# Altium project Guitar_Multi_Effect_PCB.PrjPcb
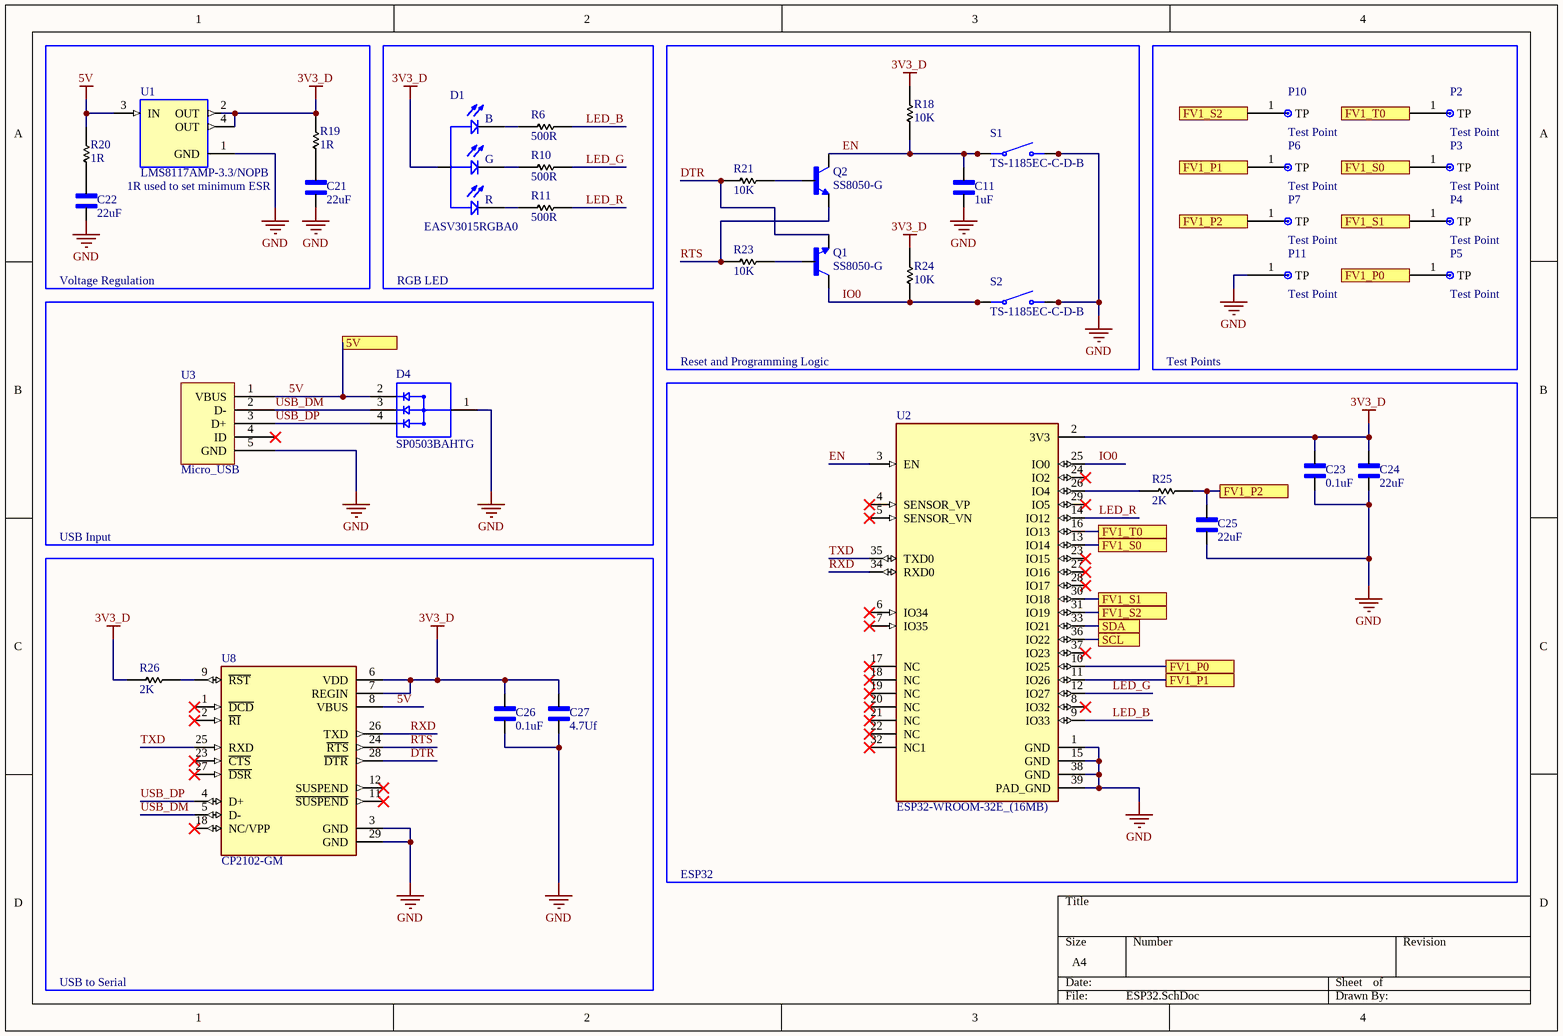
[diagram p0: ESP32.SchDoc]
2 sheets, 81 parts. Net scope: flat (ports and power ports of the same name join across sheets).
Board file: Effect_PCB.PcbDoc
Sheets:
  ESP32.SchDoc
  FV-1.SchDoc

## Sheet ESP32.SchDoc
size A4

### Parts
C11  1uF  [CHIP_0603]
C21  22uF  [CHIP_0603]
C22  22uF  [CHIP_0603]
C23  0.1uF  [CHIP_0603]
C24  22uF  [CHIP_0603]
C25  22uF  [CHIP_0603]
C26  0.1uF  [CHIP_0603]
C27  4.7Uf  [CHIP_0603]
D1  EASV3015RGBA0  [LED_EASV3015RGBA0]
D4  SP0503BAHTG  [SP0503BAHTG]
P2  Test Point  [1 Solder Pad]
P3  Test Point  [1 Solder Pad]
P4  Test Point  [1 Solder Pad]
P5  Test Point  [1 Solder Pad]
P6  Test Point  [1 Solder Pad]
P7  Test Point  [1 Solder Pad]
P10  Test Point  [1 Solder Pad]
P11  Test Point  [1 Solder Pad]
Q1  SS8050-G  [SS8050-G]
Q2  SS8050-G  [SS8050-G]
R6  500R  [CHIP_R_0603]
R10  500R  [CHIP_R_0603]
R11  500R  [CHIP_R_0603]
R18  10K  [CHIP_R_0603]
R19  1R  [CHIP_R_0603]
R20  1R  [CHIP_R_0603]
R21  10K  [CHIP_R_0603]
R23  10K  [CHIP_R_0603]
R24  10K  [CHIP_R_0603]
R25  2K  [CHIP_R_0603]
R26  2K  [CHIP_R_0603]
S1  TS-1185EC-C-D-B  [TS-1185EC-C-D-B]
S2  TS-1185EC-C-D-B  [TS-1185EC-C-D-B]
U1  LMS8117AMP-3.3/NOPB  [SOT230P700X180-4N]
U2  ESP32-WROOM-32E_(16MB)  [MODULE_ESP32-WROOM-32E]
U3  Micro_USB  [U254-051T-4BH83-F1S]
U8  CP2102-GM  [QFN50P500X500X100-29N]

### Blocks framed on the sheet
RGB LED: D1 R6 R10 R11
Reset and Programming Logic: C11 Q1 Q2 R18 R21 R23 R24 S1 S2
Test Points: P2-P7 P10 P11
ESP32: C23-C25 R25 U2

### Ports
5V, FV1_P0, FV1_P1, FV1_P2, FV1_S0, FV1_S1, FV1_S2, FV1_T0, SCL, SDA

### Nets
3V3_D: C23.1 C24.1 C26.1 C27.1 D1.1 R18.1 R19.1 R24.1 R26.2 U1.2(OUT) U1.4(OUT) U2.2(3V3) U8.6(VDD) U8.7(REGIN)
5V: D4.2 R20.1 U1.3(IN) U3.1(VBUS) U8.8(VBUS) ; port 5V
GND: C11.2 C21.2 C22.2 C23.2 C24.2 C25.2 C26.2 C27.2 D4.1 P11.1(TP) S1.3(NO) S1.4(NO) S2.3(NO) S2.4(NO) U1.1(GND) U2.1(GND) U2.15(GND) U2.38(GND) U2.39(PAD_GND) U3.5(GND) U8.3(GND) U8.29(GND)
DTR: Q1.2(E) R21.2 U8.28(~{DTR})
EN: C11.1 Q2.3(C) R18.2 S1.1(COM) S1.2(COM) U2.3(EN)
IO0: Q1.3(C) R24.2 S2.1(COM) S2.2(COM) U2.25(IO0)
LED_B: R6.1 U2.9(IO33)
LED_G: R10.1 U2.12(IO27)
LED_R: R11.1 U2.14(IO12)
RTS: Q2.2(E) R23.2 U8.24(~{RTS})
RXD: U2.34(RXD0) U8.26(TXD)
SCL: U2.36(IO22) ; port SCL
SDA: U2.33(IO21) ; port SDA
TXD: U2.35(TXD0) U8.25(RXD)
USB_DM: D4.3 U3.2(D-) U8.5(D-)
USB_DP: D4.4 U3.3(D+) U8.4(D+)
NetC21_1: C21.1 R19.2
NetC22_1: C22.1 R20.2
NetC25_1: C25.1 P7.1(TP) R25.2 ; port FV1_P2
NetD1_2: D1.2 R6.2
NetD1_3: D1.3 R10.2
NetD1_4: D1.4 R11.2
NetP2_1: P2.1(TP) U2.16(IO13) ; port FV1_T0
NetP3_1: P3.1(TP) U2.13(IO14) ; port FV1_S0
NetP4_1: P4.1(TP) U2.30(IO18) ; port FV1_S1
NetP5_1: P5.1(TP) U2.10(IO25) ; port FV1_P0
NetP6_1: P6.1(TP) U2.11(IO26) ; port FV1_P1
NetP10_1: P10.1(TP) U2.31(IO19) ; port FV1_S2
NetQ1_1: Q1.1(B) R23.1
NetQ2_1: Q2.1(B) R21.1
NetR25_1: R25.1 U2.26(IO4)
NetR26_1: R26.1 U8.9(~{RST})

Not connected (* = marked no-connect by the designer): U2 4(SENSOR_VP)* 5(SENSOR_VN)* 6(IO34)* 7(IO35)* 8(IO32)* 17(NC)* 18(NC)* 19(NC)* 20(NC)* 21(NC)* 22(NC)* 23(IO15)* 24(IO2)* 27(IO16)* 28(IO17)* 29(IO5)* 32(NC1)* 37(IO23)*; U3 4(ID)*; U8 1(~{DCD})* 2(~{RI})* 11(~{SUSPEND})* 12(SUSPEND)* 18(NC/VPP)* 23(~{CTS})* 27(~{DSR})*

### Notes on the sheet
- 1R used to set minimum ESR
- Voltage Regulation
- USB Input
- USB to Serial
- (in symbol EASV3015RGBA0) B; G; R

### Library data of the parts
C11 C21-C27 = 0603 Ceramic Capacitor: Generic 0603 Ceramic Capacitor; MP: AC0402FR-071ML; MF: Yageo; Package: 1005 Yageo; SnapEDA_Link: https://www.snapeda.com/parts/AC0402FR-071ML/Yageo/view-part/940461/?ref=snap; Value: *; Mouser-Purchase-URL: https://snapeda.com/shop?store=Mouser&id=940461; DigiKey-Purchase-URL: https://snapeda.com/shop?store=DigiKey&id=940461
D1 = EASV3015RGBA0: Red, Green, Blue _RGB_ 624nm Red, 525nm Green, 470nm Blue LED Indication - Discrete 2V Red, 3.3V Green, 3.3V Blue 4-SMD, No Lead; MF: Everlight Electronics; SnapEDA_Link: https://www.snapeda.com/parts/EASV3015RGBA0/Everlight%20Electronics%20Co%20Ltd/view-part/1921996/?ref=snap; Value: *; Price: None; Availability: Unavailable; MP: EASV3015RGBA0; Package: SMD-4 Everlight Electronics
D4 = SP0503BAHTG: 8.5V Clamp Ipp Tvs Diode Surface Mount SOT-143-4; MF: Littelfuse Inc.; MP: SP0503BAHTG; Package: SOT-143 Littelfuse; SnapEDA_Link: https://www.snapeda.com/parts/SP0503BAHTG/Littelfuse%20Inc./view-part/214427/?ref=snap; Digi-Key_Purchase_URL: https://www.digikey.com/product-detail/en/littelfuse-inc/SP0503BAHTG/F2715CT-ND/1154322?utm_source=snapeda&utm_medium=aggregator&utm_campaign=symbol; Value: *; Digi-Key_Part_Number: F2715CT-ND
P2-P7 P10 P11 = Single Test Point
Q1 Q2 = SS8050-G: NPN TRANSISTOR 1.5A 40V SOT-23 R
R6 R10 R11 R18-R21 R23-R26 = 0603 Generic Resistor: Generic 0603 Resistor
S1 S2 = TS-1185EC-C-D-B: SMD Tactile Switche - 3mm 2mm 50mA 3.65mm SPST 12V
U1 = LMS8117AMP-3.3/NOPB: Fixed 3.3V LDO 1A 15V input SOT-223   Cap ESR between 0.5-5R, 10uF minimum; MF: Texas Instruments; SnapEDA_Link: https://www.snapeda.com/parts/LMS8117AMP-3.3/NOPB/Texas%20Instruments/view-part/104396/?ref=snap; Price: None; Check_prices: https://www.snapeda.com/parts/LMS8117AMP-3.3/NOPB/Texas%20Instruments/view-part/104396/?ref=eda; Purchase-URL: https://pricing.snapeda.com/search/part/LMS8117AMP-3.3/NOPB/?ref=eda; Value: *; MP: LMS8117AMP-3.3/NOPB; Package: SOT-223-4 Texas Instruments; Availability: Warning
U2 = ESP32-WROOM-32E_(16MB): Bluetooth, WiFi 802.11b/g/n, Bluetooth v4.2 +EDR, Class 1, 2 and 3 Transceiver Module 2.4GHz ~ 2.5GHz Integrated, Trace Surface Mount; MP: ESP32-WROOM-32E (16MB); MF: Espressif Systems; Value: *; SnapEDA_Link: https://www.snapeda.com/parts/ESP32-WROOM-32E%20(16MB)/Espressif%20Systems/view-part/4792564/?ref=snap; Check_prices: https://www.snapeda.com/parts/ESP32-WROOM-32E%20(16MB)/Espressif%20Systems/view-part/4792564/?ref=eda; Availability: Unavailable; Price: None; Package: None
U3 = Micro_USB: XKB Connectivity U254-051T-4BH83-F1S
U8 = CP2102-GM: USB Bridge, USB to UART USB 2.0 UART Interface 28-QFN _5x5_; MF: Silicon Labs; Package: QFN-28 Silicon Labs; Value: *; Price: None; MP: CP2102-GM; Availability: Unavailable; SnapEDA_Link: https://www.snapeda.com/parts/CP2102-GM/Silicon%20Labs/view-part/135876/?ref=snap

## Sheet FV-1.SchDoc
size A4
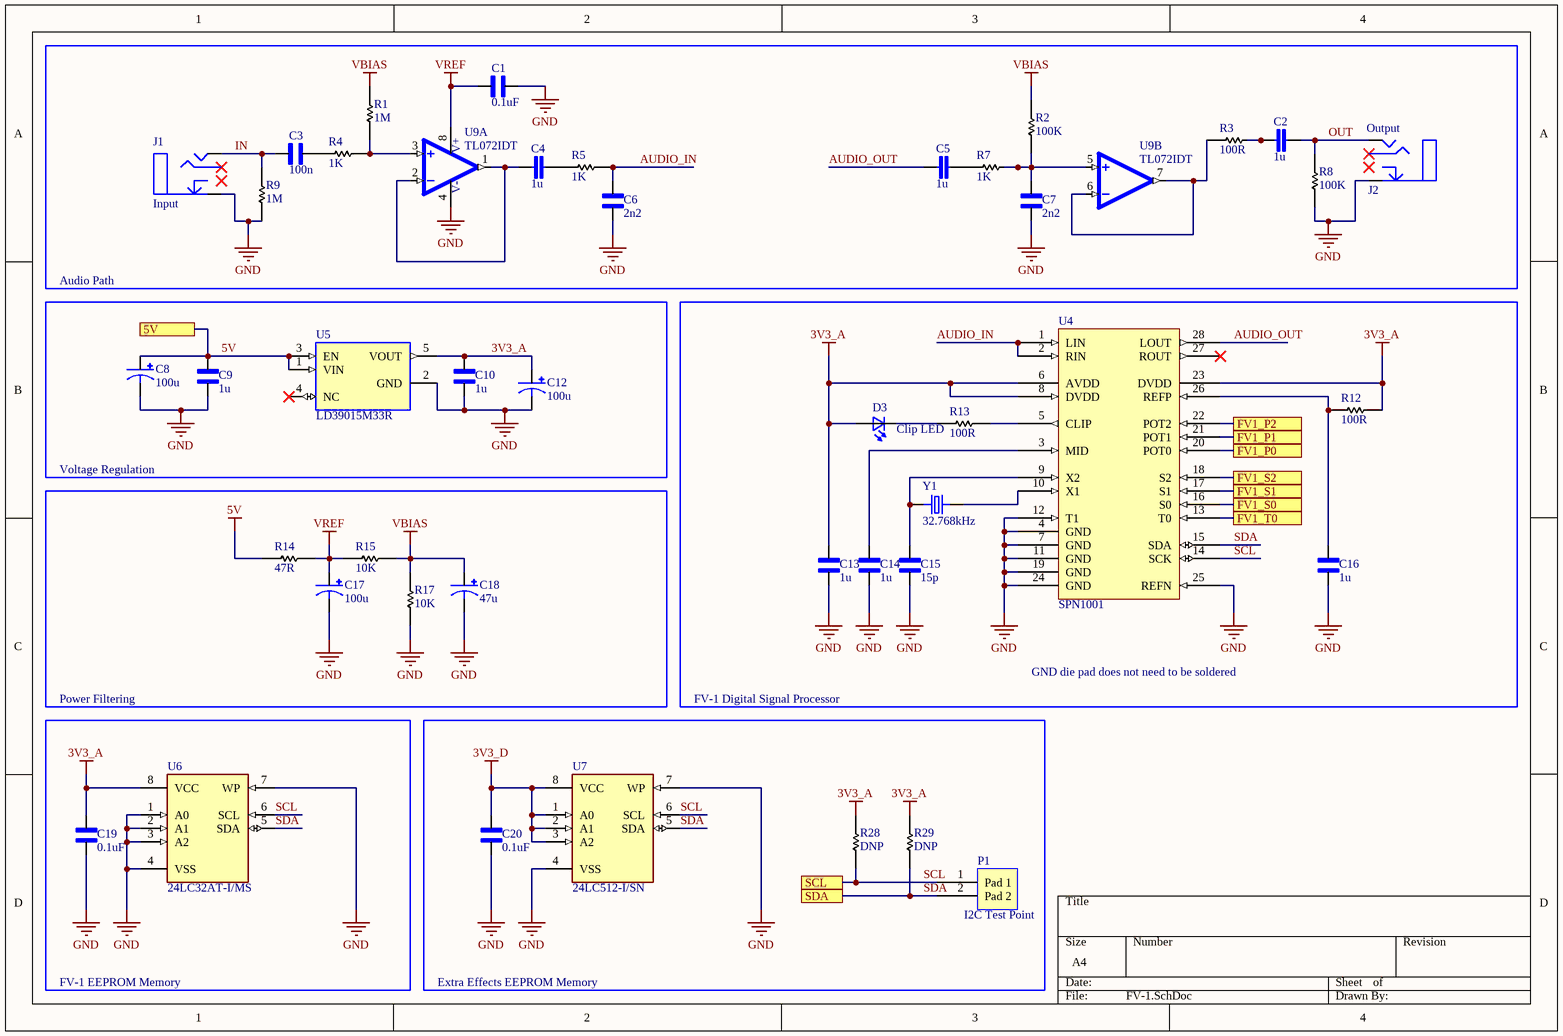
[diagram p1: FV-1.SchDoc]

### Parts
C1  0.1uF  [CHIP_0603]
C2  1u  [CHIP_1210]
C3  100n  [CAPC3216X180N]
C4  1u  [CHIP_1210]
C5  1u  [CHIP_1210]
C6  2n2  [CHIP_0603]
C7  2n2  [CHIP_0603]
C8  100u  [UCD1E101MCL1GS]
C9  1u  [CHIP_0603]
C10  1u  [CHIP_0603]
C12  100u  [UCD1E101MCL1GS]
C13  1u  [CHIP_0603]
C14  1u  [CHIP_0603]
C15  15p  [CHIP_0603]
C16  1u  [CHIP_0603]
C17  100u  [UCD1E101MCL1GS]
C18  47u  [EEE1EA470WAP]
C19  0.1uF  [CHIP_0603]
C20  0.1uF  [CHIP_0603]
D3  Clip LED  [0603 LED Generic]
J1  Input  [2 Test Points]
J2  Output  [2 Test Points]
P1  I2C Test Point  [2 Test Points]
R1  1M  [CHIP_R_0603]
R2  100K  [CHIP_R_0603]
R3  100R  [CHIP_R_0603]
R4  1K  [CHIP_R_0603]
R5  1K  [CHIP_R_0603]
R7  1K  [CHIP_R_0603]
R8  100K  [CHIP_R_0603]
R9  1M  [CHIP_R_0603]
R12  100R  [CHIP_R_0603]
R13  100R  [CHIP_R_0603]
R14  47R  [CHIP_R_0603]
R15  10K  [CHIP_R_0603]
R17  10K  [CHIP_R_0603]
R28  DNP  [CHIP_R_0603]
R29  DNP  [CHIP_R_0603]
U4  SPN1001  [SOIC-28]
U5  LD39015M33R  [SOT-23]
U6  24LC32AT-I/MS  [24LC32AT-I/MS]
U7  24LC512-I/SN  [24LC512-I/SN]
U9  TL072IDT  [TL072BIDT]  (parts A,B of 2)
Y1  32.768kHz  [XTAL_ABS07-32.768KHZ-T]

### Blocks framed on the sheet
Audio Path: C1-C7 J1 J2 R1-R5 R7-R9 U9

### Ports
5V, FV1_P0, FV1_P1, FV1_P2, FV1_S0, FV1_S1, FV1_S2, FV1_T0, SCL, SDA

### Nets
3V3_A: C10.1 C12.+ C13.1 C19.1 D3.2(A2) R12.2 R28.1 R29.1 U4.6(AVDD) U4.8(DVDD) U4.23(DVDD) U5.5(VOUT) U6.8(VCC)
3V3_D: C20.1 U7.1(A0) U7.2(A1) U7.3(A2) U7.8(VCC)
5V: C8.+ C9.1 R14.2 U5.1(VIN) U5.3(EN) ; port 5V
GND: C1.2 C6.2 C7.2 C8.- C9.2 C10.2 C12.- C13.2 C14.2 C15.2 C16.2 C17.- C18.- C19.2 C20.2 J1.2 J2.2 R8.2 R9.2 R17.2 U4.4(GND) U4.7(GND) U4.11(GND) U4.12(T1) U4.19(GND) U4.24(GND) U4.25(REFN) U5.2(GND) U6.1(A0) U6.2(A1) U6.3(A2) U6.4(VSS) U6.7(WP) U7.4(VSS) U7.7(WP) U9.4(V-)
VBIAS: C18.+ R1.1 R2.1 R15.1 R17.1
VREF: C1.1 C17.+ R14.1 R15.2 U9.8(V+)
AUDIO_IN: C6.1 R5.2 U4.1(LIN) U4.2(RIN)
AUDIO_OUT: C5.2 U4.28(LOUT)
IN: C3.2 J1.1 R9.1
OUT: C2.1 J2.1 R8.1
SCL: P1.1(Pad_1) R28.2 U4.14(SCK) U6.6(SCL) U7.6(SCL) ; port SCL
SDA: P1.2(Pad_2) R29.2 U4.15(SDA) U6.5(SDA) U7.5(SDA) ; port SDA
NetC2_2: C2.2 R3.2
NetC3_1: C3.1 R4.1
NetC4_1: C4.1 R5.1
NetC4_2: C4.2 U9.1(OUT1) U9.2(-IN1)
NetC5_1: C5.1 R7.1
NetC7_1: C7.1 R2.2 R7.2 U9.5(+IN2)
NetC14_1: C14.1 U4.3(MID)
NetC15_1: C15.1 U4.9(X2) Y1.2
NetC16_1: C16.1 R12.1 U4.26(REFP)
NetC25_1: U4.22(POT2) ; port FV1_P2
NetD3_1: D3.1(K2) R13.1
NetP2_1: U4.13(T0) ; port FV1_T0
NetP3_1: U4.16(S0) ; port FV1_S0
NetP4_1: U4.17(S1) ; port FV1_S1
NetP5_1: U4.20(POT0) ; port FV1_P0
NetP6_1: U4.21(POT1) ; port FV1_P1
NetP10_1: U4.18(S2) ; port FV1_S2
NetR1_2: R1.2 R4.2 U9.3(+IN1)
NetR3_1: R3.1 U9.6(-IN2) U9.7(OUT2)
NetR13_2: R13.2 U4.5(CLIP)
NetU4_10: U4.10(X1) Y1.1

Not connected (* = marked no-connect by the designer): U4 27(ROUT)*; U5 4(NC)*

### Notes on the sheet
- Voltage Regulation
- Power Filtering
- FV-1 Digital Signal Processor
- GND die pad does not need to be soldered
- FV-1 EEPROM Memory
- Extra Effects EEPROM Memory

### Library data of the parts
C1 C9 C10 C13-C16 C19 C20 = 0603 Ceramic Capacitor: as C11 on sheet ESP32; Package: 1005 Yageo; SnapEDA_Link: https://www.snapeda.com/parts/AC0402FR-071ML/Yageo/view-part/940461/?ref=snap; Value: *; Mouser-Purchase-URL: https://snapeda.com/shop?store=Mouser&id=940461; DigiKey-Purchase-URL: https://snapeda.com/shop?store=DigiKey&id=940461
C2 C4 C5 = ECP-U1C105MA5: CAP FILM 1UF 16V 20%; Manufacturer: Panasonic; Dielectric: PPS; Dissipation Factor: 1.5%; Insulation Resistance: 300MR; Supplier 1: Farnell; Supplier Part Number 1: 9694315; Manufacturer Part Number: ECP-U1C105MA5; RoHS: Yes; Category: Film Capacitors; Stock: 7744; Pricing: 5=0.65900, 50=0.39900, 250=0.33300, 500=0.27300, 1000=0.26400 (EUR); Mount: Surface Mount; Case/Package: 1210; Number of Pins: 2; Case Code (Metric): 3225; Contact Plating: Copper,Tin,Silver; Case Code (Imperial): 1210; Min Operating Temperature: -40°C; Max Operating Temperature: 85°C; Capacitance: 1uF; Tolerance: 20%; Termination: SMD/SMT; Voltage: 16V; Packaging: Tape and Reel; Package Quantity: 1; Voltage Rating: 16V; Voltage Rating (DC): 16V; Length: 3.2mm; Height: 1.4mm; Depth: 2.5mm; Height - Seated (Max): 0.063inch; Width: 2.5mm; Radiation Hardening: No; Lead Free: Lead Free; REACH SVHC: No SVHC; ComponentLink1URL: https://datasheet.ciiva.com/24023/abd0000ce12-181823-24023616.pdf?src-supplier=Mouser; ComponentLink1Description: https://datasheet.ciiva.com/24023/abd0000ce12-181823-24023616.pdf?src-supplier=Mouser; ComponentLink2URL: https://datasheet.ciiva.com/34303/1983192-34303533.pdf?src-supplier=Jameco; ComponentLink2Description: https://datasheet.ciiva.com/34303/1983192-34303533.pdf?src-supplier=Jameco; ComponentLink3URL: https://datasheet.ciiva.com/11790/0900766b80f2ea72-11790686.pdf?src-supplier=RSComponents; ComponentLink3Description: https://datasheet.ciiva.com/11790/0900766b80f2ea72-11790686.pdf?src-supplier=RSComponents; ComponentLink4URL: https://datasheet.ciiva.com/2992/abd0000ce12-2992994.pdf?src-supplier=Avnet; ComponentLink4Description: https://datasheet.ciiva.com/2992/abd0000ce12-2992994.pdf?src-supplier=Avnet; ComponentLink5URL: https://datasheet.ciiva.com/2992/abd0000ce12-2992995.pdf?src-supplier=Avnet; ComponentLink5Description: https://datasheet.ciiva.com/2992/abd0000ce12-2992995.pdf?src-supplier=Avnet; ComponentLink6URL: https://datasheet.ciiva.com/46399/31740-46399788.pdf?src-supplier=Element14; ComponentLink6Description: https://datasheet.ciiva.com/46399/31740-46399788.pdf?src-supplier=Element14; ComponentLink7URL: https://datasheet.ciiva.com/16433/abd0000ce12-16433502.pdf?src-supplier=Future+Electronics; ComponentLink7Description: https://datasheet.ciiva.com/16433/abd0000ce12-16433502.pdf?src-supplier=Future+Electronics; ComponentLink8URL: https://datasheet.ciiva.com/5710/31740-5710134.pdf?src-supplier=Farnell; ComponentLink8Description: https://datasheet.ciiva.com/5710/31740-5710134.pdf?src-supplier=Farnell; ComponentLink9URL: https://datasheet.ciiva.com/30120/abd0000ce12-30120298.pdf?src-supplier=Onlinecomponents.com; ComponentLink9Description: https://datasheet.ciiva.com/30120/abd0000ce12-30120298.pdf?src-supplier=Onlinecomponents.com; ComponentLink10URL: https://datasheet.ciiva.com/46399/31740-46399787.pdf?src-supplier=Element14; ComponentLink10Description: https://datasheet.ciiva.com/46399/31740-46399787.pdf?src-supplier=Element14; ComponentLink11URL: https://datasheet.ciiva.com/15164/getdatasheetpartid-292104-15164029.pdf?src-supplier=Verical; ComponentLink11Description: https://datasheet.ciiva.com/15164/getdatasheetpartid-292104-15164029.pdf?src-supplier=Verical
C3 = GRM31C5C1H104JA01L: 50V 100nF C0G ±5% 1206 Multilayer Ceramic Capacitors
C6 C7 = GRM1885C1H222JA01D: 2200PF 50V C0G/NP0 0603
C8 C12 C17 = UCD1E101MCL1GS: CAP ALUM 100UF 25V SMD; ComponentLink1URL: http://www.farnell.com/datasheets/2151198.pdf?src-supplier=Element14; ComponentLink1Description: http://www.farnell.com/datasheets/2151198.pdf?src-supplier=Element14
C18 = EEE1EA470WAP: CAP ALUM 47UF 25V SMD; ComponentLink1URL: http://www.farnell.com/datasheets/2151198.pdf?src-supplier=Farnell; ComponentLink1Description: http://www.farnell.com/datasheets/2151198.pdf?src-supplier=Farnell; ComponentLink2URL: http://www.farnell.com/datasheets/2151198.pdf?src-supplier=Element14; ComponentLink2Description: http://www.farnell.com/datasheets/2151198.pdf?src-supplier=Element14
D3 = 0603 Generic LED: Value: *
J1 J2 = Audio_Solder_Pads: Sodler pads for audio jacks; Price: 0.5
P1 = Double Test Point
R1-R5 R7-R9 R12-R15 R17 R28 R29 = 0603 Generic Resistor: Generic 0603 Resistor
U5 = LD39015M33R: Fixed 3.3V LDO 150mA SOT-23-5 Linear Voltage Regulator
U6 = 24LC32AT-I/MS: 32K I2C Serial EEPROM
U7 = 24LC512-I/SN: 512K I2C Serial EEPROM
U9 = TL072IDT: J-FET Amplifier 2 Circuit 8-SO; MF: STMicroelectronics; Availability: Unavailable; Value: *; Price: None; SnapEDA_Link: https://www.snapeda.com/parts/TL072IDT/STMicroelectronics/view-part/265326/?ref=snap; MP: TL072IDT; Package: SOIC-8 STMicroelectronics
Y1 = ABS07-32.768KHZ-T: 32.768kHz Â±20ppm Crystal 12.5pF 70 kOhms 2-SMD, No Lead; MF: Abracon LLC; Price: None; Value: *; Package: SMD-2 Abracon; Availability: Unavailable; SnapEDA_Link: https://www.snapeda.com/parts/ABS07-32.768KHZ/Abracon%20LLC/view-part/448682/?ref=snap; MP: ABS07-32.768KHZ

## Nets that join several sheets
3V3_D: ESP32 (14 pins), FV-1 (5 pins)
5V: ESP32 (5 pins), FV-1 (5 pins)
GND: ESP32 (22 pins), FV-1 (36 pins)
NetC25_1: ESP32 (C25.1 P7.1 R25.2), FV-1 (U4.22)
NetP2_1: ESP32 (P2.1 U2.16), FV-1 (U4.13)
NetP3_1: ESP32 (P3.1 U2.13), FV-1 (U4.16)
NetP4_1: ESP32 (P4.1 U2.30), FV-1 (U4.17)
NetP5_1: ESP32 (P5.1 U2.10), FV-1 (U4.20)
NetP6_1: ESP32 (P6.1 U2.11), FV-1 (U4.21)
NetP10_1: ESP32 (P10.1 U2.31), FV-1 (U4.18)
SCL: ESP32 (U2.36), FV-1 (5 pins)
SDA: ESP32 (U2.33), FV-1 (5 pins)